# Altium schematic sheet PI_R3_REV1_LED.SchDoc
size 500 x 500 mm
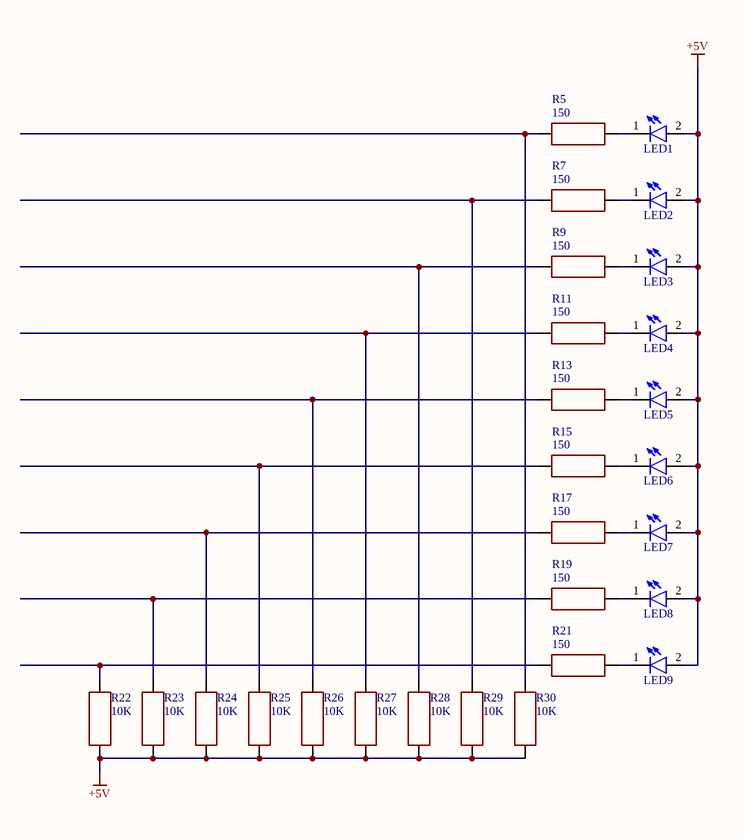
[diagram p0: PI_R3_REV1_LED.SchDoc]

## Parts
LED1  L1043  [L1043]  (value not drawn)
LED2  L1043  [L1043]  (value not drawn)
LED3  L1043  [L1043]  (value not drawn)
LED4  L1043  [L1043]  (value not drawn)
LED5  L1043  [L1043]  (value not drawn)
LED6  L1043  [L1043]  (value not drawn)
LED7  L1043  [L1043]  (value not drawn)
LED8  L1043  [L1043]  (value not drawn)
LED9  L1043  [L1043]  (value not drawn)
R5  value 150  [RES: 0402]
R7  value 150  [RES: 0402]
R9  value 150  [RES: 0402]
R11  value 150  [RES: 0402]
R13  value 150  [RES: 0402]
R15  value 150  [RES: 0402]
R17  value 150  [RES: 0402]
R19  value 150  [RES: 0402]
R21  value 150  [RES: 0402]
R22  value 10K  [RES: 0402]
R23  value 10K  [RES: 0402]
R24  value 10K  [RES: 0402]
R25  value 10K  [RES: 0402]
R26  value 10K  [RES: 0402]
R27  value 10K  [RES: 0402]
R28  value 10K  [RES: 0402]
R29  value 10K  [RES: 0402]
R30  value 10K  [RES: 0402]

## Nets
+5V: LED1.2 LED2.2 LED3.2 LED4.2 LED5.2 LED6.2 LED7.2 LED8.2 LED9.2 R22.2 R23.2 R24.2 R25.2 R26.2 R27.2 R28.2 R29.2 R30.2
NetLED1_1: LED1.1 R5.2
NetLED2_1: LED2.1 R7.2
NetLED3_1: LED3.1 R9.2
NetLED4_1: LED4.1 R11.2
NetLED5_1: LED5.1 R13.2
NetLED6_1: LED6.1 R15.2
NetLED7_1: LED7.1 R17.2
NetLED8_1: LED8.1 R19.2
NetLED9_1: LED9.1 R21.2
NetR5_1: R5.1 R30.1
NetR7_1: R7.1 R29.1
NetR9_1: R9.1 R28.1
NetR11_1: R11.1 R27.1
NetR13_1: R13.1 R26.1
NetR15_1: R15.1 R25.1
NetR17_1: R17.1 R24.1
NetR19_1: R19.1 R23.1
NetR21_1: R21.1 R22.1

## Library data of the parts
LED1-LED9 = L1043: Manufacturer: Kingbright; Datasheet: https://eu.mouser.com/datasheet/2/216/wp1043srd-1173495.pdf; HelpURL: https://eu.mouser.com/ProductDetail/Kingbright/L1043SRD?qs=fKJLI%2FsxXOeuHTGKDg%2F2bg%3D%3D; Product Category: LED Bars and Arrays
R5 R7 R9 R11 R13 R15 R17 R19 R21-R30 = Resistor_0402: Tolerance: ±5%; Product Category: Resistors; Package/Case: 0402; Temperature: -55...+125°C